# Altium schematic sheet BMS.SchDoc
size A4; SheetNumber: 2; SheetTotal: 2
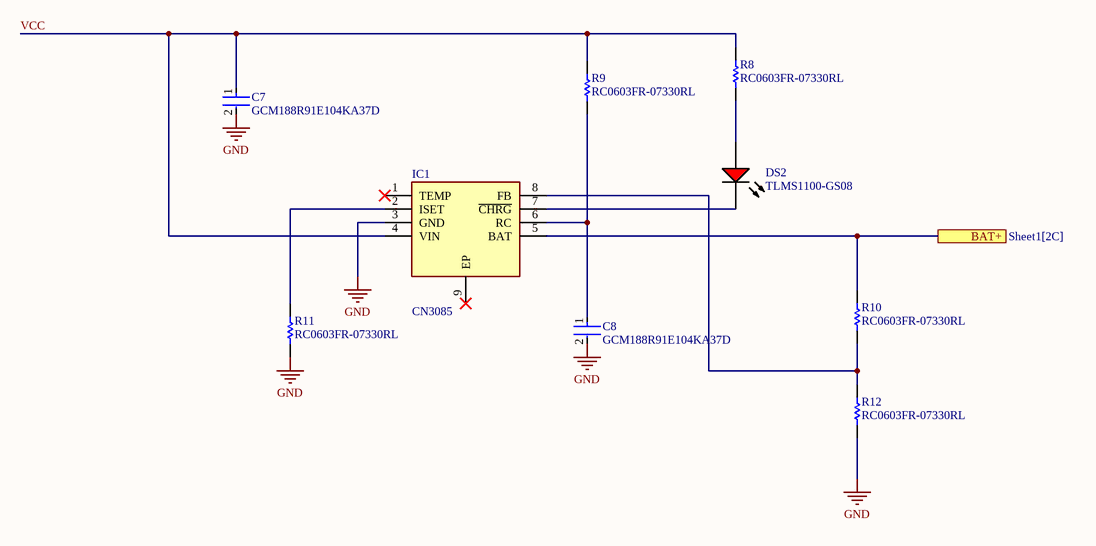
[diagram p0: BMS.SchDoc]

## Parts
C7  GCM188R91E104KA37D  [FP-GCM188-0_1-IPC_A]
C8  GCM188R91E104KA37D  [FP-GCM188-0_1-IPC_A]
DS2  TLMS1100-GS08  [VISH-TLMX1100_V]
IC1  CN3085  [SOIC127P600X175-9N]
R8  RC0603FR-07330RL  [RESC1608X55X25ML10T15]
R9  RC0603FR-07330RL  [RESC1608X55X25ML10T15]
R10  RC0603FR-07330RL  [RESC1608X55X25ML10T15]
R11  RC0603FR-07330RL  [RESC1608X55X25ML10T15]
R12  RC0603FR-07330RL  [RESC1608X55X25ML10T15]

## Ports
BAT+ (see Sheet1[2C])

## Nets
GND: C7.2 C8.2 IC1.3(GND) R11.2 R12.2
BAT+: IC1.5(BAT) R10.1 ; port BAT+
VCC: C7.1 IC1.4(VIN) R8.1 R9.1
NetC8_1: C8.1 IC1.6(RC) R9.2
NetDS2_1: DS2.1(A) R8.2
NetDS2_2: DS2.2(K) IC1.7(~{CHRG})
NetIC1_2: IC1.2(ISET) R11.1
NetIC1_8: IC1.8(FB) R10.2 R12.1

Not connected (* = marked no-connect by the designer): IC1 1(TEMP)* 9(EP)*

## Library data of the parts
C7 C8 = CMP-06035-025750-1: Ceramic Capacitor for Automotive 100nF  ±10% 25VDC X8R 0603 Paper T/R; Voltage Rating (DC): 25V; Capacitance: 100nF; Case/Package: 0603; Tolerance: 10%; Length: 1.6mm; Packaging: Tape and Reel; Depth: 0.8mm; Lead Free: Lead Free; Max Operating Temperature: 150°C; Dielectric: X8R; Min Operating Temperature: -55°C
DS2 = CMP-1666-00027-1: LED, RED, 2.1 V, -40 to 100 degC, 2-Pin SMD (0603), RoHS, Tape and Reel; Type (Capacitors): C0G; Resistance: 100000000000 Ohm; Capacitance: 12 pF; Voltage Rating: 50 V; Tolerance: 5%; Min Operating Temperature: -55degC; REACH SVHC: No SVHC; ComponentLink2Description: Datasheet; ComponentLink1URL: http://www.vishay.com/; Width: 0.8 mm; Package Quantity: 4000; PackageReference: TLMX1100; ComponentLink2URL: http://www.vishay.com/docs/83173/tlmb1100.pdf; Case/Package: 0603; Case Code (Metric): 1608; Packaging: Tape and Reel; Pins: 2; ComponentLink1Description: Manufacturer URL; Max Operating Temperature: 125degC; Height: 0.8 mm; Length: 1.6 mm; Mount: Surface Mount; PackageDescription: 2-Pin Surface Mount Device, Body 1.6 x 0.8 mm; DatasheetVersion: Rev. 2.7, 03/2016; Case Code (Imperial): 0603; Voltage Rating (DC): 50 V; RoHSCompliant: True; Radiation Hardening: No
IC1 = CN3085: Integrated Circuit; Manufacturer_Name: Consonance; Datasheet Link: http://www.consonance-elec.com/pdf/datasheet/DSE-CN3085.pdf; Height: 1.75mm; Manufacturer_Part_Number: CN3085
R8-R12 = CMP-1659-00020-2: Chip Resistor, 330 Ohm, +/- 1%, 0.1 W, -55 to 155 degC, 0603 (1608 Metric), RoHS, Tape and Reel; Tolerance: 10%; ESR: 800 mohm; Voltage Rating (DC): 16 V; Capacitance: 47 uF; Length: 7.3 mm; ComponentLink1URL: http://www.yageo.com/; Packaging: Tape and Reel; Pins: 2; ComponentLink1Description: Manufacturer URL; Case Code (Imperial): 2917; REACH SVHC: No SVHC; Width: 4.3 mm; ComponentLink2Description: Datasheet; Voltage Rating: 16 V; RoHSCompliant: True; Max Operating Temperature: 125degC; ComponentLink2URL: http://www.yageo.com/documents/recent/PYu-RC_Group_51_RoHS_L_04.pdf; Min Operating Temperature: -55degC; Case/Package: 2917; Radiation Hardening: No; DatasheetVersion: Rev. 4, 02/2016; Mount: Surface Mount; PackageReference: 0603; Package Quantity: 500; Case Code (Metric): 7343; PackageDescription: 2-Pin Surface Mount Device, Body 1.6 x 0.8 mm; Height: 3.1 mm